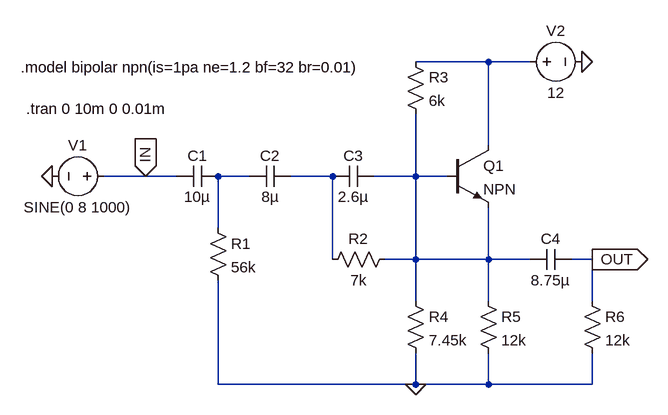
[diagram p0: schematic schema.asc]
schema.asc, the LTspice schematic file:
Version 4
SHEET 1 892 680
WIRE 624 -48 512 -48
WIRE 688 -48 624 -48
WIRE 624 80 624 -48
WIRE 96 128 32 128
WIRE 144 128 96 128
WIRE 256 128 208 128
WIRE 384 128 320 128
WIRE 512 128 512 32
WIRE 512 128 448 128
WIRE 560 128 512 128
WIRE 208 208 208 128
WIRE 384 256 384 128
WIRE 512 256 512 128
WIRE 512 256 464 256
WIRE 624 256 624 176
WIRE 624 256 512 256
WIRE 688 256 624 256
WIRE 784 256 752 256
WIRE 512 320 512 256
WIRE 624 320 624 256
WIRE 784 320 784 256
WIRE 208 448 208 288
WIRE 512 448 512 400
WIRE 512 448 208 448
WIRE 624 448 624 400
WIRE 624 448 512 448
WIRE 784 448 784 400
WIRE 784 448 624 448
FLAG -48 128 0
FLAG 512 448 0
FLAG 768 -48 0
FLAG 96 128 IN
IOPIN 96 128 In
FLAG 784 256 OUT
IOPIN 784 256 Out
SYMBOL voltage 48 128 R90
WINDOW 0 -32 56 VBottom 2
WINDOW 3 32 56 VTop 2
WINDOW 123 0 0 Left 0
WINDOW 39 0 0 Left 0
SYMATTR InstName V1
SYMATTR Value SINE(0 8 1000)
SYMBOL cap 208 112 R90
WINDOW 0 0 32 VBottom 2
WINDOW 3 32 32 VTop 2
SYMATTR InstName C1
SYMATTR Value 10µ
SYMBOL cap 320 112 R90
WINDOW 0 0 32 VBottom 2
WINDOW 3 32 32 VTop 2
SYMATTR InstName C2
SYMATTR Value 8µ
SYMBOL cap 448 112 R90
WINDOW 0 0 32 VBottom 2
WINDOW 3 32 32 VTop 2
SYMATTR InstName C3
SYMATTR Value 2.6µ
SYMBOL res 192 192 R0
SYMATTR InstName R1
SYMATTR Value 56k
SYMBOL res 480 240 R90
WINDOW 0 0 56 VBottom 2
WINDOW 3 32 56 VTop 2
SYMATTR InstName R2
SYMATTR Value 7k
SYMBOL res 496 -64 R0
SYMATTR InstName R3
SYMATTR Value 6k
SYMBOL npn 560 80 R0
SYMATTR InstName Q1
SYMBOL res 496 304 R0
SYMATTR InstName R4
SYMATTR Value 7.45k
SYMBOL res 608 304 R0
SYMATTR InstName R5
SYMATTR Value 12k
SYMBOL res 768 304 R0
SYMATTR InstName R6
SYMATTR Value 12k
SYMBOL cap 752 240 R90
WINDOW 0 0 32 VBottom 2
WINDOW 3 32 32 VTop 2
SYMATTR InstName C4
SYMATTR Value 8.75µ
SYMBOL voltage 672 -48 R270
WINDOW 0 32 56 VTop 2
WINDOW 3 -32 56 VBottom 2
WINDOW 123 0 0 Left 0
WINDOW 39 0 0 Left 0
SYMATTR InstName V2
SYMATTR Value 12
TEXT -96 -40 Left 2 !.model bipolar npn(is=1pa ne=1.2 bf=32 br=0.01)
TEXT -88 24 Left 2 !.tran 0 10m 0 0.01m

The netlist it stands for:
* schema.asc
V1 IN 0 SINE(0 8 1000)
C1 N002 IN 10µ
C2 N003 N002 8µ
C3 N004 N003 2.6µ
R1 N002 0 56k
R2 N004 N003 7k
R3 N001 N004 6k
Q1 N001 N004 N004 0 NPN
R4 N004 0 7.45k
R5 N004 0 12k
R6 OUT 0 12k
C4 OUT N004 8.75µ
V2 N001 0 12
.model NPN NPN
.model PNP PNP
.lib standard.bjt
.model bipolar npn(is=1pa ne=1.2 bf=32 br=0.01)
.tran 0 10m 0 0.01m
.backanno
.end